# EAGLE design xdoftof_revA (EAGLE 9.4.2)
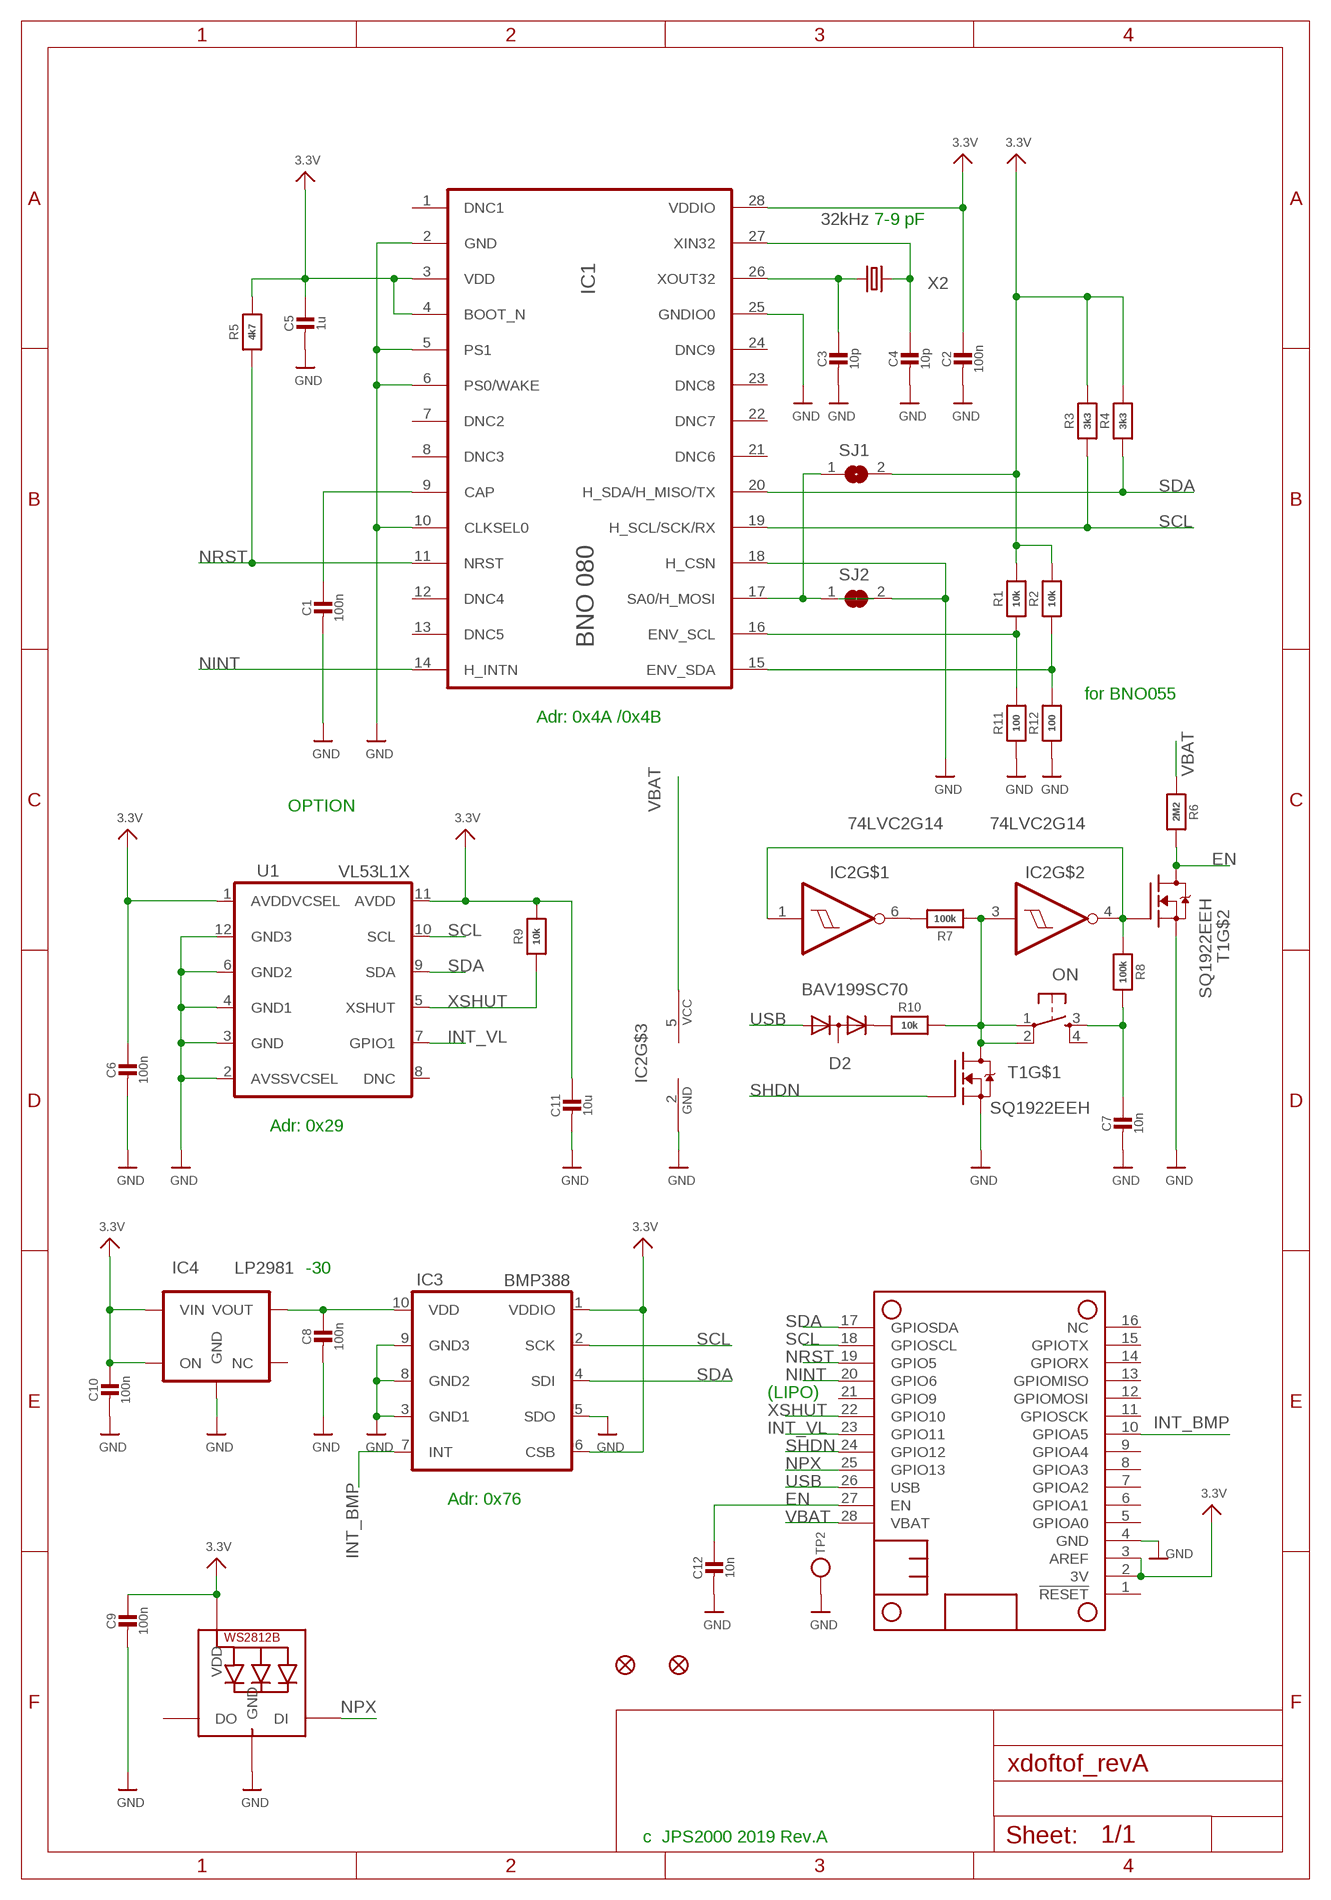
[diagram p0: schematic, sheet 1]

## Parts
C1  100n  CAP_CERAMIC0603_NO  [0603-NO]
C2  100n  CAP_CERAMIC0603_NO  [0603-NO]
C3  10p  CAP_CERAMIC0603_NO  [0603-NO]
C4  10p  CAP_CERAMIC0603_NO  [0603-NO]
C5  1u  CAP_CERAMIC0603_NO  [0603-NO]
C6  100n  CAP_CERAMIC0603_NO  [0603-NO]
C7  10n  CAP_CERAMIC0603_NO  [0603-NO]
C8  100n  CAP_CERAMIC0603_NO  [0603-NO]
C9  100n  CAP_CERAMIC0603_NO  [0603-NO]
C10  100n  CAP_CERAMIC0603_NO  [0603-NO]
C11  10u  CAP_CERAMIC0603_NO  [0603-NO]
C12  10n  CAP_CERAMIC0603_NO  [0603-NO]
D2  BAV199SC70  [SC70]
FID1  FIDUCIAL""  [FIDUCIAL_1MM]
FID2  FIDUCIAL""  [FIDUCIAL_1MM]
IC1  BNO080  [LGA28]
IC2  74LVC2G14  [SC70-6]
IC3  BMP388  [LGA10]
IC4  LP2981  [SOT23-5_NEW]
LED1  WS2812B3535  [LED3535]
MS1  FEATHERWING_NOHOLES  [FEATHERWING_NOHOLES]
ON  ON/OFF  TACTSW_SMD  [TACTSWSKQGABE010]
R1  10k  RESISTOR_0603MP  [_0603MP]
R2  10k  RESISTOR_0603MP  [_0603MP]
R3  3k3  RESISTOR_0603MP  [_0603MP]
R4  3k3  RESISTOR_0603MP  [_0603MP]
R5  4k7  RESISTOR_0603MP  [_0603MP]
R6  2M2  RESISTOR_0603MP  [_0603MP]
R7  100k  RESISTOR_0603MP  [_0603MP]
R8  100k  RESISTOR_0603MP  [_0603MP]
R9  10k  RESISTOR_0603MP  [_0603MP]
R10  10k  RESISTOR_0603MP  [_0603MP]
R11  100  RESISTOR_0603MP  [_0603MP]
R12  100  RESISTOR_0603MP  [_0603MP]
SJ1  SOLDERJUMPERREFLOW_NOPASTE  [SOLDERJUMPER_REFLOW_NOPASTE]
SJ2  SOLDERJUMPERCLOSED  [SOLDERJUMPER_CLOSEDWIRE]
T1  SQ1922EEH  DUAL_NMOS  [SC70-6]
TP2  TESTPOINTROUND1MM  [TESTPOINT_ROUND_1MM]
U1  VL53L1X  [VL53L1X]
X2  32kHz  XTAL_SMD  [XTAL_SMD1]

## Nets
3.3V: C2.1 C5.1 C6.1 C9.1 C10.1 C11.1 IC1.3(VDD) IC1.4(BOOT_N) IC1.28(VDDIO) IC3.1(VDDIO) IC3.6(CSB) IC4.P$1(VIN) IC4.P$3(ON) LED1.2(VDD) MS1.2(3V) MS1.3(AREF) R1.2 R2.2 R3.2 R4.2 R5.2 R9.2 SJ1.2 U1.1(AVDDVCSEL) U1.11(AVDD)
EN: C12.1 MS1.27(EN) R6.2 T1.3(D)
GND: C1.2 C2.2 C3.2 C4.2 C5.2 C6.2 C7.2 C8.2 C9.2 C10.2 C11.2 C12.2 IC1.2(GND) IC1.5(PS1) IC1.6(PS0/WAKE) IC1.10(CLKSEL0) IC1.18(H_CSN) IC1.25(GNDIO0) IC2.2(GND) IC3.3(GND1) IC3.5(SDO) IC3.8(GND2) IC3.9(GND3) IC4.P$2(GND) LED1.4(GND) MS1.4(GND) R11.1 R12.1 SJ2.2 T1.1(S) T1.4(S) TP2.P$1 U1.2(AVSSVCSEL) U1.3(GND) U1.4(GND1) U1.6(GND2) U1.12(GND3)
INT_BMP: IC3.7(INT) MS1.10(GPIOA5)
INT_VL: MS1.23(GPIO11) U1.7(GPIO1)
N$1: C8.1 IC3.10(VDD) IC4.P$5(VOUT)
N$2: C4.1 IC1.27(XIN32) X2.P$2
N$3: C3.1 IC1.26(XOUT32) X2.P$1
N$4: IC1.16(ENV_SCL) R1.1 R11.2
N$5: IC1.15(ENV_SDA) R2.1 R12.2
N$6: IC2.6(O) R7.2
N$7: C1.1 IC1.9(CAP)
N$8: D2.2(C) R10.1
N$9: IC2.3(I) ON.1 ON.2 R7.1 R10.2 T1.6(D)
N$10: IC1.17(SA0/H_MOSI) SJ1.1 SJ2.1
N$11: C7.1 ON.3 R8.2
N$12: IC2.1(I) IC2.4(O) R8.1 T1.5(G)
NINT: IC1.14(H_INTN) MS1.20(GPIO6)
NPX: LED1.1(DI) MS1.25(GPIO13)
NRST: IC1.11(NRST) MS1.19(GPIO5) R5.1
SCL: IC1.19(H_SCL/SCK/RX) IC3.2(SCK) MS1.18(GPIOSCL) R3.1 U1.10(SCL)
SDA: IC1.20(H_SDA/H_MISO/TX) IC3.4(SDI) MS1.17(GPIOSDA) R4.1 U1.9(SDA)
SHDN: MS1.24(GPIO12) T1.2(G)
USB: D2.1(A) MS1.26(USB)
VBAT: IC2.5(VCC) MS1.28(VBAT) R6.1
XSHUT: MS1.22(GPIO10) R9.1 U1.5(XSHUT)
Unconnected: D2.3(AC) IC1.1(DNC1) IC1.7(DNC2) IC1.8(DNC3) IC1.12(DNC4) IC1.13(DNC5) IC1.21(DNC6) IC1.22(DNC7) IC1.23(DNC8) IC1.24(DNC9) IC4.P$4(NC) LED1.3(DO) MS1.1(!RESET) MS1.5(GPIOA0) MS1.6(GPIOA1) MS1.7(GPIOA2) MS1.8(GPIOA3) MS1.9(GPIOA4) MS1.11(GPIOSCK) MS1.12(GPIOMOSI) MS1.13(GPIOMISO) MS1.14(GPIORX) MS1.15(GPIOTX) MS1.16(NC) MS1.21(GPIO9) ON.4 U1.8(DNC)

## Notes on the sheet
- 7-9 pF
- for BNO055
- Adr: 0x4A /0x4B
- OPTION
- Adr: 0x29
- -30
- (LIPO)
- Adr: 0x76
- c  JPS2000 2019 Rev.A

## Library data of the parts
C1-C12 = microbuilder:CAP_CERAMIC: Ceramic Capacitors For new designs, use the packages preceded by an '_' character since they are more reliable: The following footprints should be used on most boards: _0402 - Standard footprint for regular board layouts _0603 - Standard footprint for regular board layouts _0805 - Standard footprint for regular board layouts _1206 - Standard footprint for regular board layouts For extremely tight-pitch boards where space is at a premium, the following 'micro-pitch' footprints can be used (smaller pads, no silkscreen outline, etc.): _0402MP - Micro-pitch footprint for very dense/compact boards _0603MP - Micro-pitch footprint for very dense/compact boards _0805MP - Micro-pitch footprint for very dense/compact boards _1206MP - Micro-pitch footprint for very dense/compact boards
D2 = JPS:BAV199
FID1 FID2 = Adafruit VL53L0X:FIDUCIAL: Fiducial Alignment Points Various fiducial points for machine vision alignment.; BOM: EXCLUDE
IC1 = JPS:BNO080
IC2 = JPS:74LVC2G14
IC3 = JPS:BMP388
IC4 = JPS:LP2981
LED1 = adafruit:WS2812B
MS1 = microbuilder:FEATHERWING
ON = JPS:TACTSW_SMD
R1-R12 = microbuilder:RESISTOR: Resistors For new designs, use the packages preceded by an '_' character since they are more reliable: The following footprints should be used on most boards: _0402 - Standard footprint for regular board layouts _0603 - Standard footprint for regular board layouts _0805 - Standard footprint for regular board layouts _1206 - Standard footprint for regular board layouts For extremely tight-pitch boards where space is at a premium, the following 'micro-pitch' footprints can be used (smaller pads, no silkscreen outline, etc.): _0402MP - Micro-pitch footprint for very dense/compact boards _0603MP - Micro-pitch footprint for very dense/compact boards _0805MP - Micro-pitch footprint for very dense/compact boards _1206MP - Micro-pitch footprint for very dense/compact boards
SJ1 SJ2 = microbuilder:SOLDERJUMPER: SMD Solder JUMPER Solder the two pads together to create a connection, or remove the solder to break it. REFLOW - Use this footprint for solder paste and reflow ovens. WAVE - Use this footprint for hand-soldering (larger pads). CLOSED - Has a trace between the two pads to ensure it is closed by default. The trace needs to be cut to disable the jumper, and can be closed again by creating a solder bridge between the two pads.
T1 = JPS:DUAL_NMOS
TP2 = microbuilder:TESTPOINT: Test Point Various test points for characterisation and PCB testing TESTPOINT_SMT - Compact Surface Mount Test Point [Digikey: 5016KTR-ND]
U1 = JPS:VL53L1X
X2 = JPS:XTAL_SMD

## Board
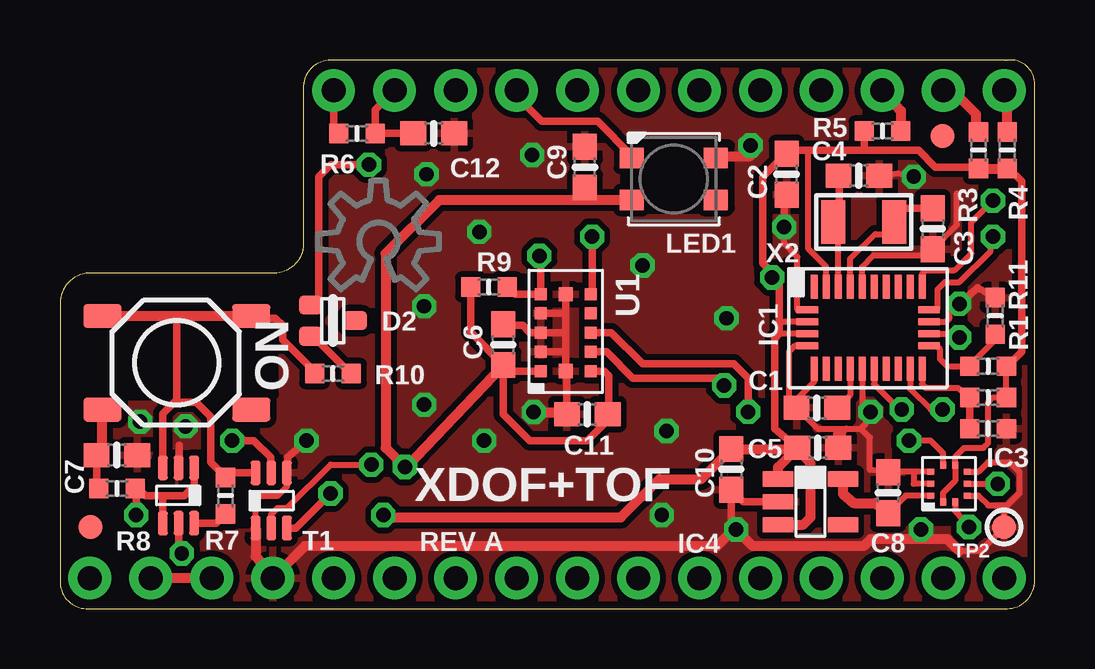
[diagram p1: board, top side]
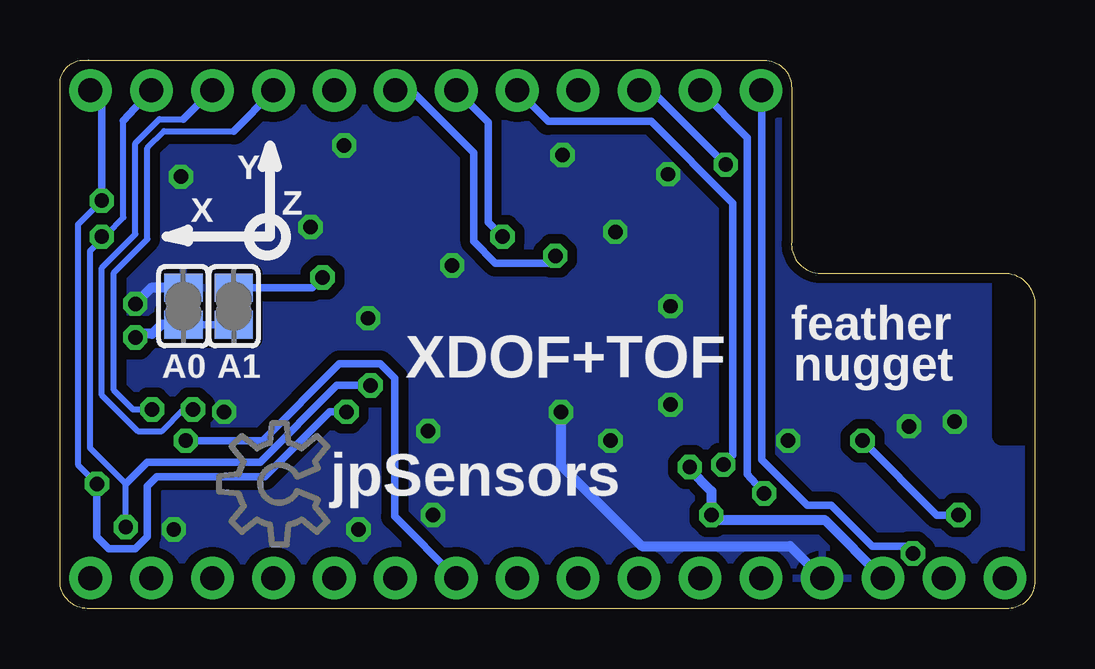
[diagram p2: board, bottom side, seen from below]

Size 40.61 x 22.86 mm. Coordinates in mm from the lower left corner, seen from the top.
Copper layers (1*16): Top 0.035mm / dielectric 1.5mm / Bottom 0.035mm
Design rules "adafruit *": minimum track width 8mil, minimum drill 15.5mil, track to track 8mil, track to pad 8mil, pad to pad 8mil, via to via 8mil, smd to smd 8mil, copper to edge 12mil, drill to drill 8mil, minimum pad ring 10mil, minimum via ring 8mil, stop-mask expansion 2mil, vias tented up to drill 20mil, thermal gap 10mil
tRestrict: area 35.5,3.7 to 38.7,6.9; area 30.3,9.1 to 37.6,14.4; area 17.6,11.4 to 19.5,13.7; area 28.1,4.3 to 30.2,6.4; area 5.2,3.6 to 9.4,6; area 23.6,16.7 to 27.9,19.3
bRestrict: area -1,7.2 to 1.4,13.7

### Footprints (pad centres in the part's own frame; a part is rotated, then mirrored left to right if it is on the bottom)
0603-NO = smd 1.075 x 1: 1 -0.85,0; 2 0.85,0
SC70 = smd 0.8 x 1: 1 -0.65,-0.925; 2 0.65,-0.925; 3 0,0.925
FIDUCIAL_1MM = smd 1 x 1: 1 0,0
LGA28 = smd 0.29 x 1: 1 -2.25,1.71; 6 -2.25,-1.71; 7 -1.75,-1.71; 8 -1.25,-1.71; 9 -0.75,-1.71; 10 -0.25,-1.71; 11 0.25,-1.71; 12 0.75,-1.71; 13 1.25,-1.71; 14 1.75,-1.71; 15 2.25,-1.71; 20 2.25,1.71; 21 1.75,1.71; 22 1.25,1.71; 23 0.75,1.71; 24 0.25,1.71; 25 -0.25,1.71; 26 -0.75,1.71; 27 -1.25,1.71; 28 -1.75,1.71 | smd 0.9 x 0.29: 2 -2.538,0.75; 3 -2.538,0.25; 4 -2.538,-0.25; 5 -2.538,-0.75; 16 2.538,-0.75; 17 2.538,-0.25; 18 2.538,0.25; 19 2.538,0.75
SC70-6 = smd 0.41 x 1.02: 1 -0.62,-1.14; 2 0.03,-1.14; 3 0.68,-1.14; 4 0.68,1.16; 5 0.03,1.16; 6 -0.62,1.16
LGA10 = smd 0.25 x 0.3: 1 0.25,0.762; 2 -0.25,0.762; 6 -0.25,-0.762; 7 0.25,-0.762 | smd 0.3 x 0.25: 3 -0.762,0.5; 4 -0.762,0; 5 -0.762,-0.5; 8 0.762,-0.5; 9 0.762,0; 10 0.762,0.5
SOT23-5_NEW = smd 0.635 x 1.27: P$1 -1,-1.35; P$2 -0.05,-1.35; P$3 0.9,-1.35; P$4 0.9,1.35; P$5 -1,1.35
LED3535 = smd 1 x 0.85: 1 -1.75,0.875; 2 -1.75,-0.875; 3 1.75,-0.875; 4 1.75,0.875
FEATHERWING_NOHOLES = drill 1 pad 1.778: 1 1.27,1.27; 2 3.81,1.27; 3 6.35,1.27; 4 8.89,1.27; 5 11.43,1.27; 6 13.97,1.27; 7 16.51,1.27; 8 19.05,1.27; 9 21.59,1.27; 10 24.13,1.27; 11 26.67,1.27; 12 29.21,1.27; 13 31.75,1.27; 14 34.29,1.27; 15 36.83,1.27; 16 39.37,1.27; 17 39.37,21.59; 18 36.83,21.59; 19 34.29,21.59; 20 31.75,21.59; 21 29.21,21.59; 22 26.67,21.59; 23 24.13,21.59; 24 21.59,21.59; 25 19.05,21.59; 26 16.51,21.59; 27 13.97,21.59; 28 11.43,21.59
TACTSWSKQGABE010 = smd 1.6 x 1: 1 -3.1,1.95; 2 3.1,1.95; 3 -3.1,-1.95; 4 3.1,-1.95
_0603MP = smd 0.8 x 0.8: 1 -0.762,0; 2 0.762,0
SOLDERJUMPER_REFLOW_NOPASTE = smd 1.168 x 1.6: 1 -0.762,0; 2 0.762,0
SOLDERJUMPER_CLOSEDWIRE = smd 1.168 x 1.6: 1 -0.762,0; 2 0.762,0 | smd 0.635 x 0.203: WIRE 0,0
TESTPOINT_ROUND_1MM = smd 1 x 1: P$1 0,0
VL53L1X = smd 0.5 x 0.5: 1 1.6,-1.05; 2 0.8,-1.05; 3 0,-1.05; 4 -0.8,-1.05; 5 -1.6,-1.05; 7 -1.6,1.05; 8 -0.8,1.05; 9 0,1.05; 10 0.8,1.05; 11 1.6,1.05 | smd 0.6 x 0.6: 6 -1.6,0; 12 1.6,0
XTAL_SMD1 = smd 1.8 x 1: P$1 0,-1.27; P$2 0,1.27

### Placement (x,y rotation side)
C1  31.54,8.36 180 top
C2  30.27,18.1 270 top
C3  36.36,15.83 270 top
C4  33.29,18.03 0 top
C5  31.57,6.7 0 top
C6  18.47,11 90 top
C7  2.37,6.4 0 top
C8  34.5,4.83 90 top
C9  21.87,18.4 90 top
C10  27.97,5.8 270 top
C11  21.97,8.1 180 top
C12  15.57,19.8 0 top
D2  11.37,12 270 top
FID1  1.27,3.4 0 top
FID2  36.77,19.7 0 top
IC1  33.67,11.7 0 top
IC2  4.97,4.72 180 top
IC3  37.04,5.21 180 top
IC4  31.27,4.4 270 top
LED1  25.57,17.9 0 top
MS1  -0.03,0 0 top
ON  4.87,10.24 0 top
R1  38.67,10.1 0 top
R2  38.67,8.8 0 top
R3  38.27,19.1 270 top
R4  39.47,19.1 270 top
R5  34.27,19.9 180 top
R6  12.37,19.8 0 top
R7  6.89,4.71 270 top
R8  2.38,5.01 180 top
R9  17.87,13.4 180 top
R10  11.37,9.8 180 top
R11  38.97,12.2 270 top
R12  38.67,7.5 180 top
SJ1  33.37,12.6 90 bottom
SJ2  35.47,12.6 90 bottom
T1  8.77,4.5 0 top
TP2  39.34,3.39 0 top
U1  21.07,11.5 270 top
U$36  [OPENSOURCE]  13.27,15.3 0 top
U$37  [OPENSOURCE]  31.47,5.2 90 bottom
X2  33.49,16.11 90 top

### Tracks (layer width: path | path; a pad name or v marks a point on that pad's centre or on a via)
3.3V  (via drill 0.6)
  Top 0.203: C9.1 21.57,17.25 21.57,17.03
  Top 0.254: 31.92,13.45 IC1.28 31.92,14.25 31.17,15 31.17,19.1 | IC3.1 36.8,4.82 37.3,5.32 IC3.6 37.3,6.32 37.67,6.7 38.47,6.7 38.67,6.9 38.67,8.6 38.87,8.8 R2.2 | IC1.4 29.97,11.45 | 39.53,18.34 R4.2 | C5.1 30.47,6.8 30.47,6.7 | C2.1 30.42,19.05 | 30.42,19.15 30.07,19.15 C2.1 | IC1.3 30.22,11.95 29.97,11.9 | 30.42,19.1 C2.1 | 38.11,18.4 R3.2 | 33.51,19.14 33.57,19.1 | 39.27,9.9 R1.2 R2.2 | 39.17,8.6 R2.2 | 29.97,13.8 v29.67,13.8
  Top 0.305: 39.53,18.34 40.07,17.8 40.07,10.7 39.27,9.9 | 38.11,18.4 36.47,18.4 35.77,19.1 33.57,19.1 31.17,19.1 30.42,19.1 | 29.97,13.7 29.97,11.9 29.97,11.45 29.77,11.25 29.77,7.5 C5.1 | 29.97,13.8 29.97,13.7 | 30.42,19.15 29.27,18 29.27,14.4 29.97,13.7 | R5.2 33.51,19.14 | C6.1 17.11,11.51 R9.2 | U1.1 18.92,9.9 C6.1 | U1.11 22.67,9.9 22.87,9.7 22.87,8.55 C11.1 22.82,7.85 21.97,7 19.57,7 18.47,8.1 C6.1
  Top 0.406: MS1.3 MS1.2 | R3.2 R4.2 | IC4.P$1 29.92,5.9 C5.1 | IC4.P$3 30.97,3.5 31.27,3.8 31.27,6.05 C5.1 | 21.97,17.45 C9.1 | v13.47,3.9 13.67,3.8 23.37,3.8 24.97,5.4 26.72,5.4 C10.1 30.67,6.65 C5.1 | C6.1 14.42,5.9 v14.37,5.9 13.57,6.7 13.57,14.8 15.8,17.03 21.57,17.03 LED1.2 23.85,17.03
  Bottom 0.254: 6.27,1.32 MS1.3
  Bottom 0.305: SJ1.2 30.11,13.36 v29.67,13.8
  Bottom 0.406: MS1.3 8.75,3.7 13.37,3.7 13.47,3.8 v13.47,3.9 13.47,4.9 14.37,5.8 v14.37,5.9
EN  (via drill 0.6)
  Top 0.305: MS1.27 13.13,20.78 R6.2 C12.1 | T1.3 9.83,3.36 v11.27,4.8
  Bottom 0.305: v11.27,4.8 11.97,5.6 11.97,19.62 MS1.27
GND  (via drill 0.6)
  Top 0.203: C3.2 36.09,14.7
  Top 0.254: IC1.2 30.72,12.45 30.72,14.65 30.17,15.2 v30.17,15.9 | IC3.8 35.58,5.71 35.57,5.7 | 35.57,5.7 35.57,5.2 35.58,5.21 IC3.9 | 39.47,4.3 39.97,4.8 39.97,5.7 39.57,6.1 38.67,6.1 38.28,5.71 IC3.5 | IC3.3 38.27,4.71 38.67,4.3 39.47,4.3 | 35.57,5.7 34.58,5.7 C8.2 33.75,5.78 33.75,7.12 33.37,7.5 | 36.09,14.7 33.87,14.7 33.42,14.24 IC1.25 | C3.2 37.35,15.98 37.37,16 37.37,17.3 | 35.77,17.9 v35.57,18 34.91,18.13 C4.2 | IC1.10 33.42,8.45 v33.77,8.2 33.57,7.7 33.37,7.5 | IC1.6 31.42,9.45 30.67,8.7 | 32.77,7.5 31.57,7.5 30.79,8.28 C1.2 30.67,8.55 30.67,8.7 | 32.77,7.5 33.37,7.5 | IC1.5 30.62,10.95 30.37,10.7 30.37,8.8 30.67,8.7 | 37.47,2.4 38.37,2.4 38.47,2.52 TP2.P$1 39.34,4.17 39.47,4.3 | 32.54,7.27 32.77,7.5 | T1.4 9.45,5.08 9.07,4.7 8.17,4.7 8.15,4.58 T1.1 | IC1.18 36.92,11.95 37.07,12.1 37.07,12.3 v37.47,12.7
  Top 0.305: IC2.2 4.97,5.83 4.97,6.8 | LED1.4 27.32,18.85 | v10.27,7 9.49,6.3 T1.4 | 21.07,10.7 U1.12 21.12,9.85 C11.2 | 21.07,10.7 21.07,11.5 | 21.07,11.5 21.07,12.2 | 21.07,12.2 U1.6 | 21.07,11.5 U1.3 19.57,11.5 19.27,11.8 18.72,11.8 C6.2 | U1.4 20.97,12.3 21.07,12.2 | U1.2 21.07,10.7 | v28.17,3.3 27.97,3.5 C10.2 28.47,4.45 IC4.P$2 | v30.17,15.9 30.17,17.15 C2.2 | R11.1 38.23,13.36 v37.47,12.7
  Top 0.406: T1.1 8.15,2.18 MS1.4 10.19,2.6 27.37,2.6 28.07,3.3 v28.17,3.3 | 32.54,7.27 32.42,7.27 C5.2 | 37.47,2.4 36.97,2.9 33.77,2.9 33.47,2.6 28.87,2.6 v28.17,3.3 | 28.27,3.4 v28.17,3.3 | v19.74,8.19 21.11,8.19 C11.2 | 27.32,18.85 28.77,18.85 v28.77,19.3
  Bottom 0.406: v19.74,8.19 19.74,5.97 16.37,2.6 10.19,2.6 MS1.4 | SJ2.2 36.81,13.36 v37.47,12.7
  other vias: 5.24,7.59 27.77,12.1 25.27,7.4 19.67,18.9 15.17,8.5 3.34,7.79 17.47,15.7 15.27,18.1 17.67,7 24.27,14.3 15.17,12.6 35.87,3.3 25.07,3.9
  pour Bottom (isolate 0.406): 9.97,23.2 40.87,23.2 40.97,23 40.97,0.1 41.17,0 0.17,0 -0.03,0.2 -0.03,14.4 10.07,14.4
  pour Top (isolate 0.254): 10.17,22.8 40.87,22.9 40.87,0.05 -0.03,-0.15 -0.03,14.4 10.17,14.4
INT_BMP  (via drill 0.6)
  Top 0.254: IC3.7 36.8,6.48 36.27,7 v35.37,7
  Bottom 0.305: v35.37,7 32.17,7 28.97,10.2 27.27,10.2 26.67,9.6 26.67,3.84 MS1.10
INT_VL  (via drill 0.6)
  Top 0.305: v22.17,15.5 22.17,13.15 U1.7
  Bottom 0.305: v22.17,15.5 22.77,16.1 22.77,20.26 MS1.23
N$1
  Top 0.254: IC3.10 35.23,4.71 C8.1
  Top 0.406: IC4.P$5 32.62,4.78 33.07,4.4 33.95,4.4 C8.1
N$2
  Top 0.254: IC1.27 32.42,15.21 X2.P$2 32.24,16.13
  Top 0.305: C4.1 32.47,18.1 32.47,16.2 32.4,16.13 32.24,16.13
N$3
  Top 0.254: IC1.26 32.92,14.58 33.97,15.6 34.78,15.61 X2.P$1 | X2.P$1 34.66,15.69 | 35.23,16.68 X2.P$1
  Top 0.305: C3.1 35.23,16.68
N$4
  Top 0.254: IC1.16 36.52,10.95 36.67,10.8 36.67,10.4 36.97,10.1 R1.1 | 38.11,10 R1.1 | R1.1 37.97,10.2 38.97,11.2 R11.2
N$5
  Top 0.254: IC1.15 35.92,9.35 36.07,9.2 37.41,9.2 R2.1
  Top 0.305: R2.1 R12.2
N$6
  Top 0.254: 6.97,3.9 R7.2
  Top 0.305: IC2.6 6.51,3.56 R7.2
N$7
  Top 0.254: IC1.9 32.92,8.9 C1.1
N$8
  Top 0.305: D2.2 10.55,11.35 12.1,9.8 R10.1
N$9
  Top 0.305: T1.6 7.19,5.66 R7.1 6.89,5.52 6.27,6.11 6.27,8 5.67,8.6 4.97,8.6 4.87,8.7 | IC2.3 4.29,8.12 4.87,8.7 | 4.87,8.7 4.87,12.09 4.77,12.19 | ON.2 7.87,12.1 8.98,12.1 9.27,11.8 9.27,11.2 10.61,9.86 R10.2
  Top 0.406: ON.2 4.77,12.19 ON.1
N$10  (via drill 0.6)
  Top 0.254: IC1.17 37.42,11.45 v37.47,11.3
  Bottom 0.305: SJ1.1 SJ2.1
  Bottom 0.406: SJ2.1 36.38,11.84 36.77,11.45 37.32,11.45 v37.47,11.3
N$11
  Top 0.305: C7.1 1.52,5.1 R8.2
  Top 0.406: C7.1 1.77,6.4 ON.3
N$12  (via drill 0.6)
  Top 0.305: T1.5 8.77,5.7 8.77,6.3 8.07,7 v7.17,7 | IC2.1 5.59,5.12 5.17,4.7 4.27,4.7 | IC2.4 4.29,4.38 4.27,4.7 | 4.27,4.7 3.57,4.7 3.26,5.01 R8.1 3.17,4.94 v3.17,3.9
  Bottom 0.305: v3.17,3.9 4.07,3.9 v7.17,7
NINT  (via drill 0.6)
  Top 0.254: IC1.14 35.42,9.15 36.27,8.3 v36.77,8.3
  Bottom 0.254: 33.37,19.9 36.27,19.9 36.97,19.2 36.97,15.4 38.37,14 38.37,9.1 37.57,8.3 v36.77,8.3
  Bottom 0.305: 33.37,19.9 31.72,21.55 MS1.20
NPX
  Top 0.305: MS1.25 19.02,21.35 20.07,20.3 22.4,20.3 23.82,18.88 LED1.1
NRST  (via drill 0.6)
  Top 0.254: IC1.11 33.92,9.35 34.97,8.3 v35.07,8.3
  Top 0.406: MS1.19 35.03,20.75 R5.1
  Bottom 0.254: 35.47,20.4 36.47,20.4 37.47,19.4 37.47,15.6 38.87,14.2 38.87,8.9 37.37,7.4 36.37,7.4 35.47,8.3 v35.07,8.3
  Bottom 0.305: 35.47,20.4 MS1.19
SCL  (via drill 0.6)
  Top 0.254: IC3.2 37.3,4.08 v37.87,3.4 | IC1.19 36.32,12.45 36.57,12.5 36.57,13.3 36.87,13.6 37.47,13.6 38.77,14.9 38.77,15.4 v38.87,15.5
  Top 0.305: U1.10 22.77,10.7 23.87,9.6 27.37,9.6 v27.67,9.3
  Top 0.406: R3.1 38.17,20.02 38.17,20.6 37.17,21.6 MS1.18
  Bottom 0.254: 38.67,15.6 37.97,16.3 37.97,20.32 | v38.87,15.5 38.67,15.6 | 38.67,15.6 39.37,14.9 39.37,6.7 37.87,5.2 v37.87,3.4
  Bottom 0.305: 37.97,20.32 MS1.18 | v27.67,9.3 29.07,9.3 32.27,6.1 36.97,6.1 37.87,5.2
SDA  (via drill 0.6)
  Top 0.254: IC1.20 35.92,13.95 36.07,14.1 37.27,14.1 37.97,14.8 37.97,16.1 v38.87,17 | IC3.4 v39.06,5.21 v39.07,5.2
  Top 0.305: 39.27,21.52 MS1.17 | U1.9 22.97,11.5 24.27,10.2 28.07,10.2 28.67,9.6 v28.67,8.2
  Top 0.406: R4.1 39.47,21.4 39.27,21.52
  Bottom 0.254: v39.07,5.2 39.87,6 39.87,16 v38.87,17
  Bottom 0.305: v38.87,17 38.87,21.12 MS1.17 | v28.67,8.2 29.37,8.2 32.07,5.5 36.57,5.5 36.97,5.1 36.97,3 37.47,2.5 38.57,2.5 39.07,3 v39.07,5.2
SHDN  (via drill 0.6)
  Top 0.254: T1.2 8.8,3.93 9.07,4.2 9.47,4.2 11.27,6 v12.97,6
  Bottom 0.305: v12.97,6 12.57,6.4 12.57,16.9 15.97,20.3 20.27,20.3 MS1.24
USB  (via drill 0.6)
  Top 0.305: D2.1 10.55,12.68 10.77,12.7 10.77,18 11.27,18.5 v12.87,18.5
  Bottom 0.305: v12.87,18.5 15.87,21.5 16.39,21.5 MS1.26
VBAT  (via drill 0.6)
  Top 0.203: 4.94,2.43 v5.07,2.3
  Top 0.305: MS1.28 11.4,20.01 R6.1 | IC2.5 4.94,2.43
  Bottom 0.305: v5.07,2.3 5.27,2.6 6.77,2.6 8.47,4.3 9.47,4.3 11.37,6.2 11.37,21.56 MS1.28
XSHUT  (via drill 0.6)
  Top 0.305: R9.1 18.63,13.46 18.61,13.46 18.97,13.1 U1.5 20.02,14.75 v19.97,14.7 20.07,14.7
  Bottom 0.305: v19.97,14.7 20.27,14.4 22.47,14.4 23.37,15.3 23.37,19 25.97,21.6 MS1.22

### Text on the board
bPlace: jpSensors
tNames: XDOF+TOF | REV A
bNames: Y | Z | X | feather | XDOF+TOF | nugget | A1 | A0